# Altium project Backplane_board_MaxSize_test.PrjPcb
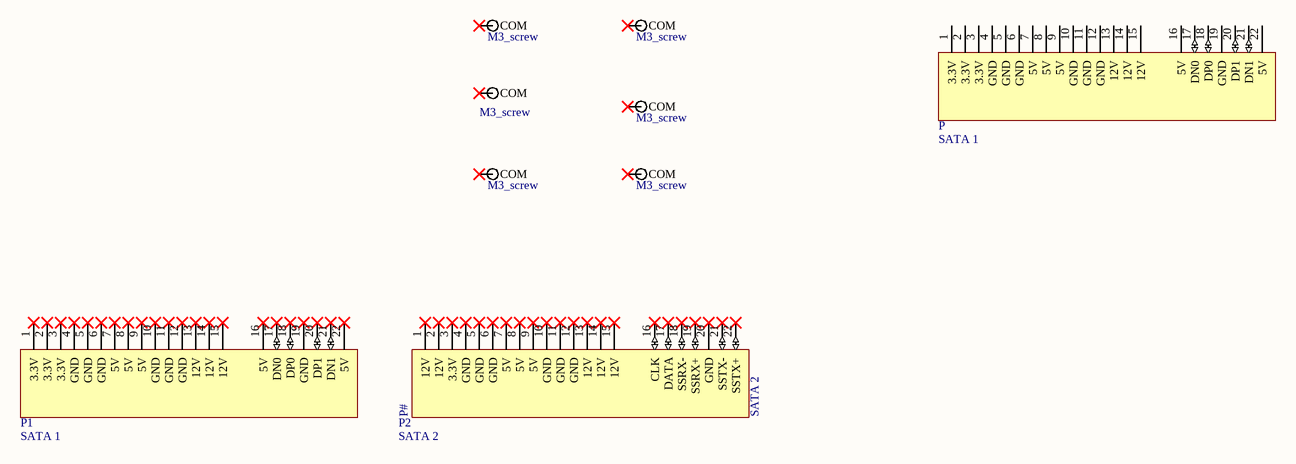
[diagram p0: Test.SchDoc]
1 sheet, 9 parts. Net scope: global (net labels, ports and power ports of the same name join across sheets).
Board file: Board.PcbDoc

## Sheet Test.SchDoc
size A4; SheetNumber: 1; SheetTotal: 1

### Parts
P  SATA 1  [SATA Female]
P1  SATA 1  [Amphenol 10101788-002CLF]
P2  SATA 2  [Amphenol 10101788-002CLF]
TH1  M3_screw  [m3screw]
TH2  M3_screw  [m3screw]
TH3  M3_screw  [m3screw]
TH4  M3_screw  [m3screw]
TH5  M3_screw  [m3screw]
TH6  M3_screw  [m3screw]

### Nets

Not connected (* = marked no-connect by the designer): P 1(3.3V) 2(3.3V) 3(3.3V) 4(GND) 5(GND) 6(GND) 7(5V) 8(5V) 9(5V) 10(GND) 11(GND) 12(GND) 13(12V) 14(12V) 15(12V) 16(5V) 17(DN0) 18(DP0) 19(GND) 20(DP1) 21(DN1) 22(5V); P1 1(3.3V)* 2(3.3V)* 3(3.3V)* 4(GND)* 5(GND)* 6(GND)* 7(5V)* 8(5V)* 9(5V)* 10(GND)* 11(GND)* 12(GND)* 13(12V)* 14(12V)* 15(12V)* 16(5V)* 17(DN0)* 18(DP0)* 19(GND)* 20(DP1)* 21(DN1)* 22(5V)*; P2 1(12V)* 2(12V)* 3(3.3V)* 4(GND)* 5(GND)* 6(GND)* 7(5V)* 8(5V)* 9(5V)* 10(GND)* 11(GND)* 12(GND)* 13(12V)* 14(12V)* 15(12V)* 16(CLK)* 17(DATA)* 18(SSRX-)* 19(SSRX+)* 20(GND)* 21(SSTX-)* 22(SSTX+)*; TH1 0(COM)*; TH2 0(COM)*; TH3 0(COM)*; TH4 0(COM)*; TH5 0(COM)*; TH6 0(COM)*

### Notes on the sheet
- (in symbol SATA 2) P#

### Library data of the parts
P P1 = SATA 1: SATA connector. / Connector 1 for option 1 as per Spec; Supplier 1: Digi-Key
P2 = SATA 2: SATA connector. / Connector 2 for option 1 as per Spec; Supplier 1: Digi-Key